# EAGLE design UFO (EAGLE 7.6.0)
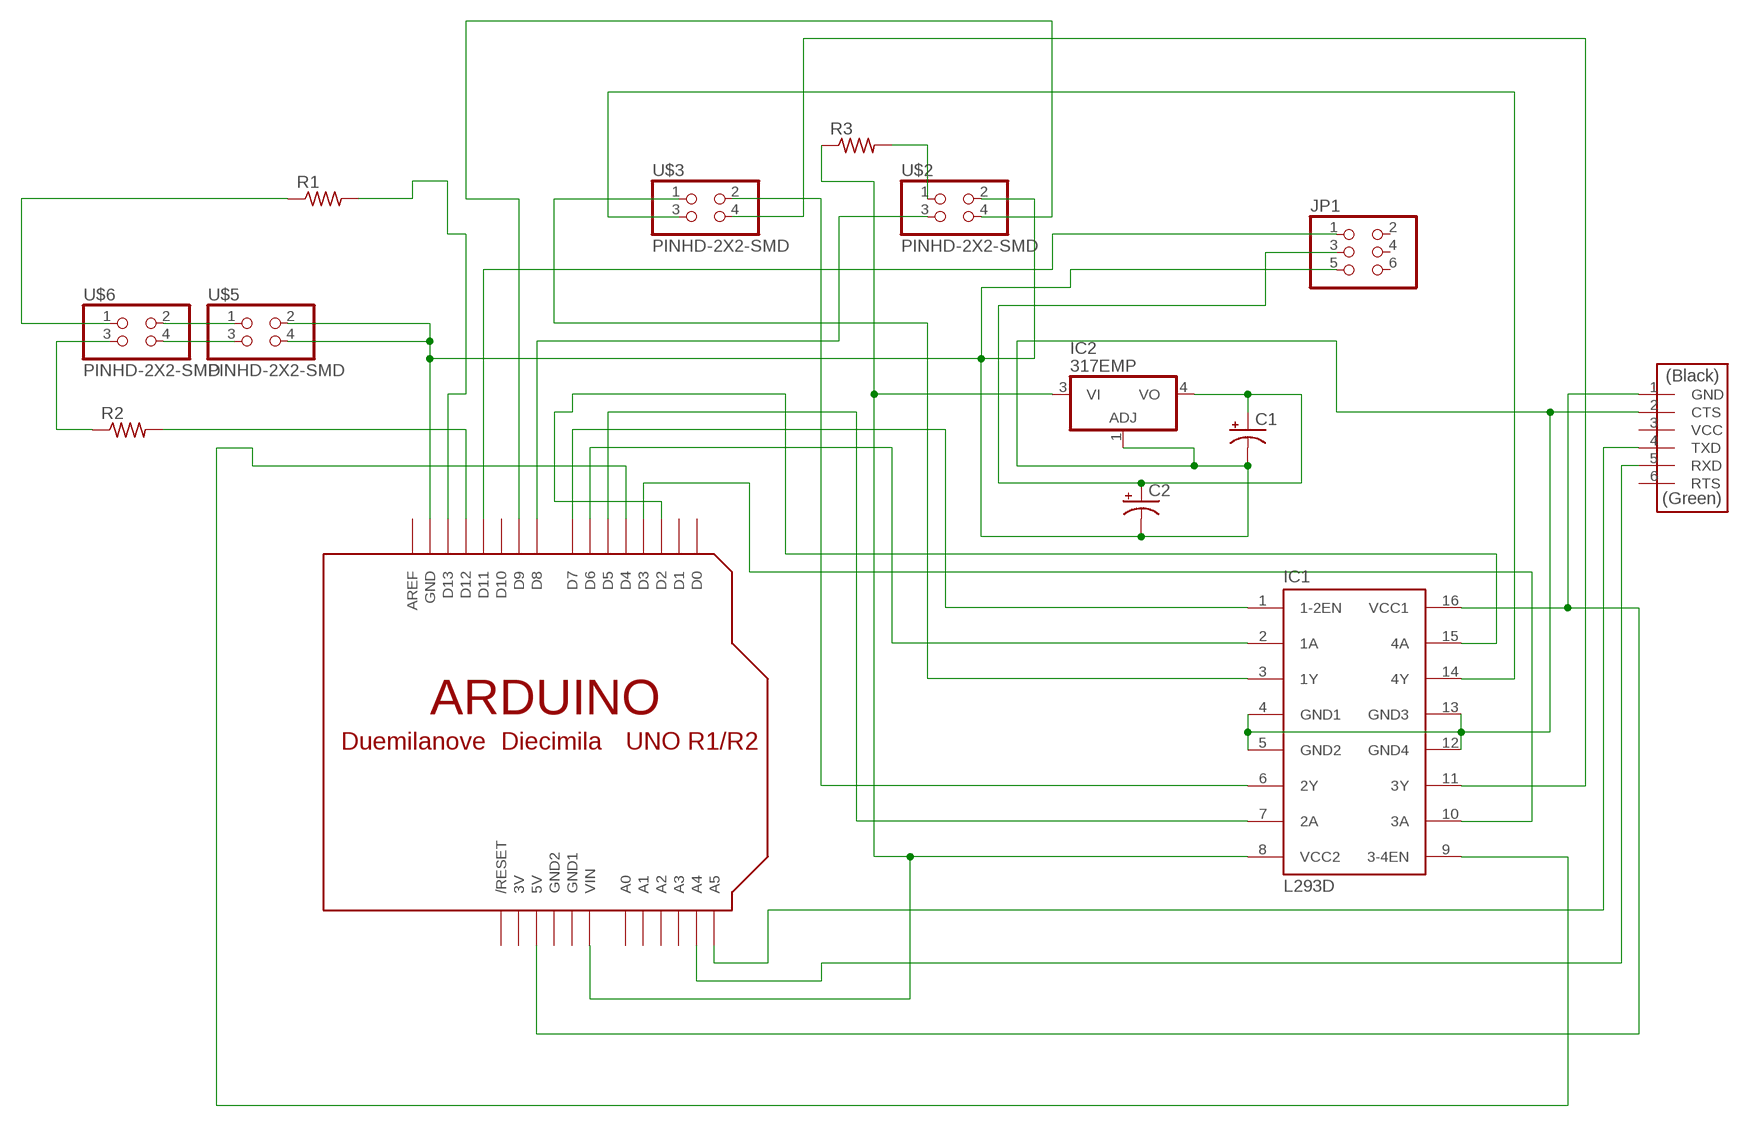
[diagram p0: schematic, sheet 1]

## Parts
C1  CPOL-USE/7260-38W  [E/7260-38W]
C2  CPOL-USE/7260-38W  [E/7260-38W]
IC1  L293D  [DIL16]
IC2  317EMP  [SOT223]
JP1  PINHD-2X3-SMD  [2X03SMD]
R1  RES-US1206  [R1206]
R2  RES-US1206  [R1206]
R3  RES-US1206FAB  [R1206FAB]
U$1  ARDUINO-NOHOLE  [ARDUINO-NOHOLE]
U$2  PINHD-2X2-SMD  [2X02SMD]
U$3  PINHD-2X2-SMD  [2X02SMD]
U$4  FTDI-SMD-HEADER  [1X06SMD]
U$5  PINHD-2X2-SMD  [2X02SMD]
U$6  PINHD-2X2-SMD  [2X02SMD]

## Nets
N$1: R3.2 U$2.1
N$3: IC1.1(1-2EN) U$1.D7
N$4: IC1.2(1A) U$1.D6
N$5: IC1.7(2A) U$1.D5
N$6: IC1.15(4A) U$1.D2
N$7: IC1.10(3A) U$1.D3
N$8: IC1.9(3-4EN) U$1.D4
N$9: IC1.3(1Y) U$3.1
N$10: IC1.6(2Y) U$3.2
N$11: IC1.14(4Y) U$3.3
N$12: IC1.11(3Y) U$3.4
N$13: IC1.8(VCC2) IC2.3(VI) R3.1 U$1.VIN
N$14: IC1.16(VCC1) U$1.5V U$4.1(GND)
N$16: R1.2 U$1.D13
N$17: C1.- C2.- IC1.4(GND1) IC1.5(GND2) IC1.12(GND4) IC1.13(GND3) IC2.1(ADJ) JP1.5 U$1.GND U$2.2 U$4.2(CTS) U$5.2 U$5.4
N$18: U$5.3 U$6.4
N$19: U$1.A5 U$4.4(TXD)
N$20: U$1.A4 U$4.5(RXD)
N$21: U$5.1 U$6.2
N$22: U$1.D8 U$2.3
N$23: U$1.D9 U$2.4
N$24: R2.2 U$1.D12
N$27: R2.1 U$6.3
N$28: R1.1 U$6.1
N$29: C1.+ C2.+ IC2.4(VO) JP1.3
N$30: JP1.1 U$1.D11
Unconnected: JP1.2 JP1.4 JP1.6 U$1.A0 U$1.A1 U$1.A2 U$1.A3 U$1.AREF U$1.D0 U$1.D1 U$1.D10 U$1.RESET(/RESET) U$4.3(VCC) U$4.6(RTS)

## Power pins joined to a net without a drawn wire
3V: U$1.3V
GND1: U$1.GND1
GND2: U$1.GND2

## Library data of the parts
C1 C2 = kesäseteli kirjasto:CPOL-US: POLARIZED CAPACITOR, American symbol
IC1 = kesäseteli kirjasto:L293D: PUSH-PULL 4 CHANNEL DRIVER; MPN: L293D; OC_FARNELL: 9589619; OC_NEWARK: 56P8249
IC2 = kesäseteli kirjasto:*317: Positive VOLTAGE REGULATOR
JP1 = kesäseteli kirjasto:PINHD-2X3-SMD: PIN HEADER
R1-R3 = kesäseteli kirjasto:RES-US: Resistor (US Symbol) Variants with postfix FAB are widened to allow the routing of internal traces
U$1 = kesäseteli kirjasto:ARDUINO: Arduino Diecimila/Duemilanove Make a shield with ease, this package has all the named pins as well as the two mounting drill holes and an outline of the USB and DC power connector. The outline is on the DIMENSION layer, so if your board house uses it they will cut the outline to match. http://www.ladyada.net/library/pcb/eaglelibrary.html
U$2 U$3 U$5 U$6 = kesäseteli kirjasto:PINHD-2X2-SMD
U$4 = kesäseteli kirjasto:FTDI-SMD-HEADER

## Board
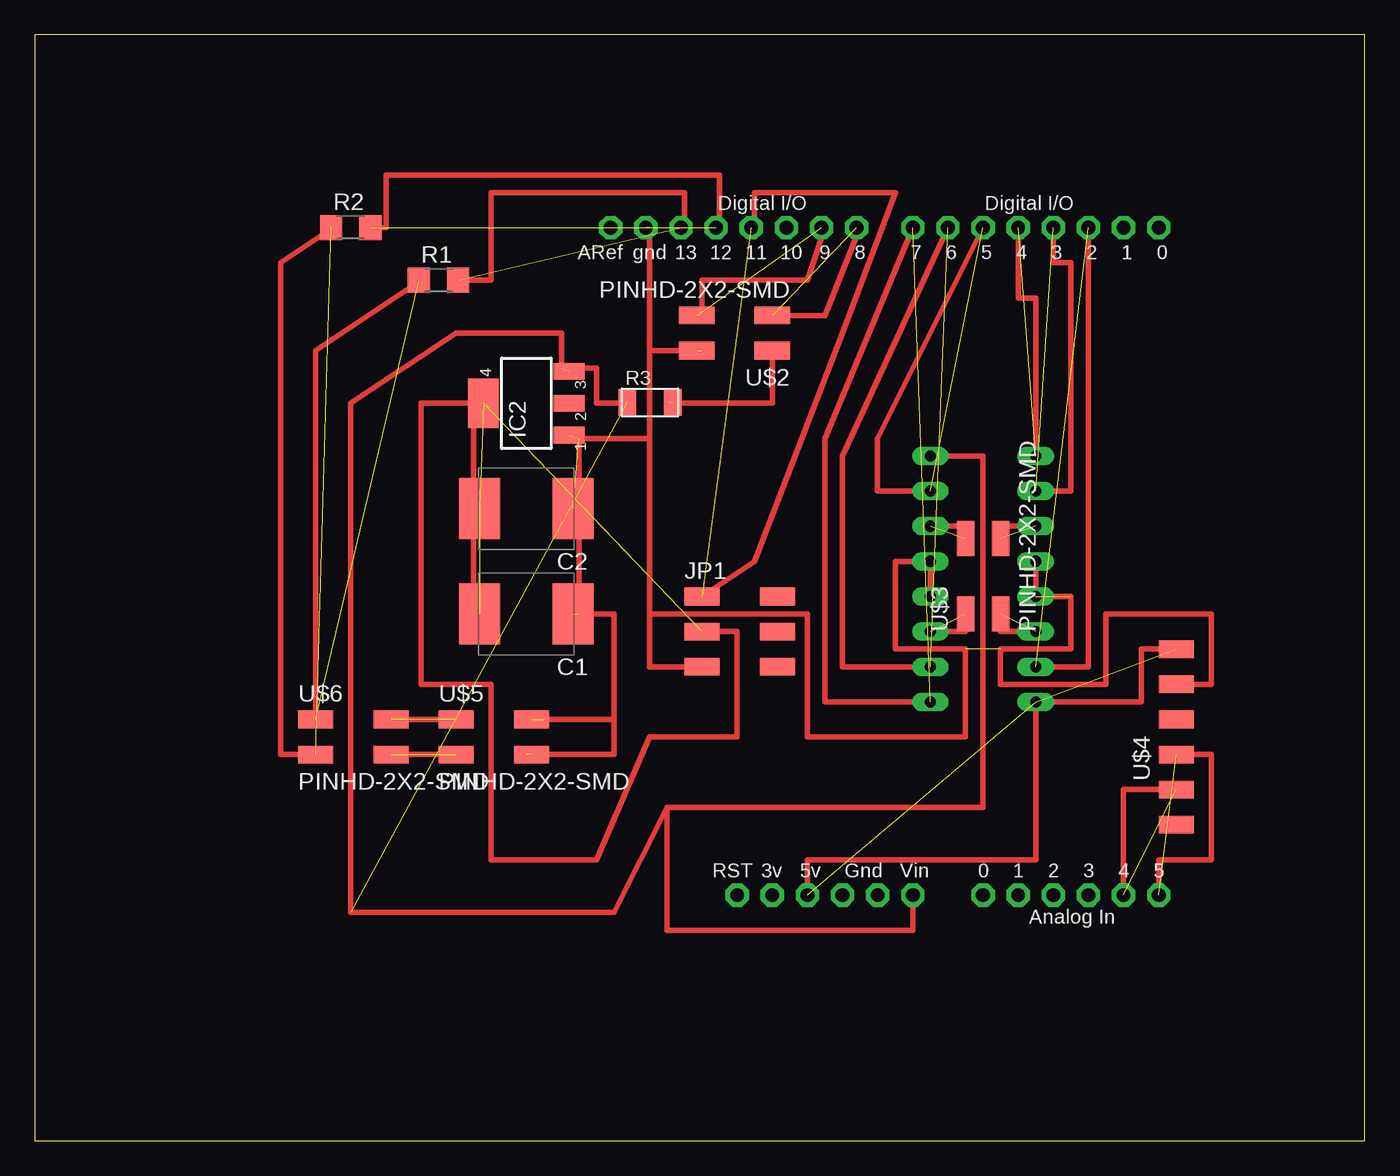
[diagram p1: board, top side]
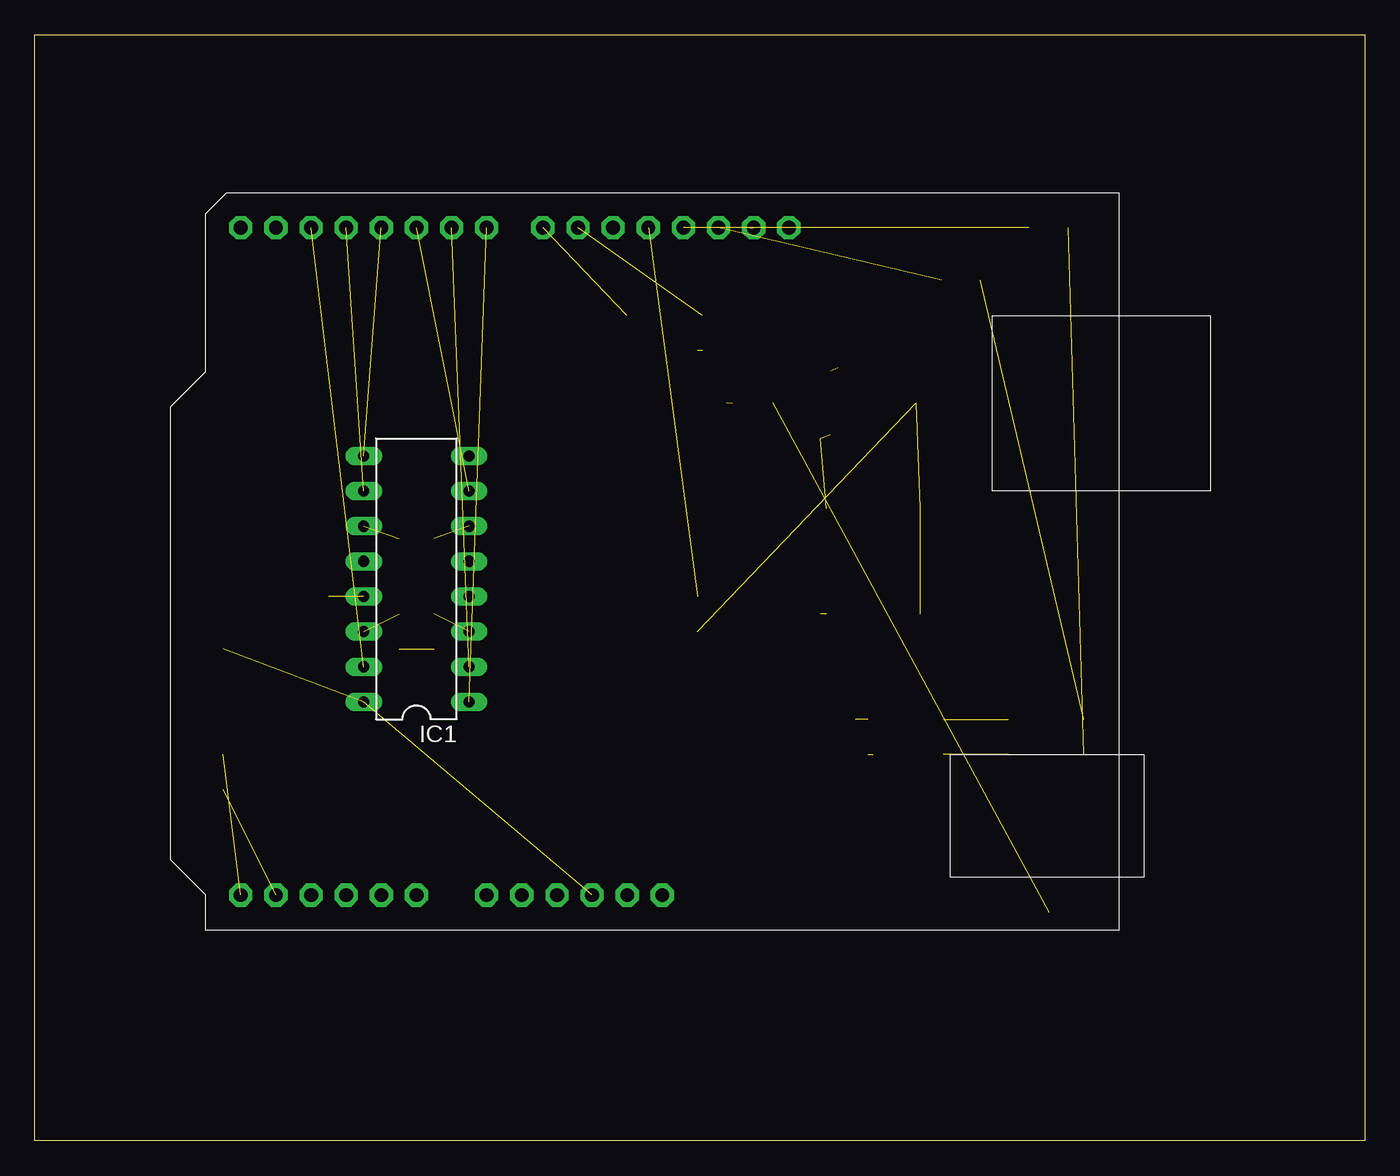
[diagram p2: board, bottom side, seen from below]

Size 96.19 x 80 mm. Coordinates in mm from the lower left corner, seen from the top.
Outline: 0,0 96.19,0 96.19,80 0,80 0,0
Copper layers (1*16): Top 0.035mm / dielectric 1.5mm / Bottom 0.035mm
Design rules "default": minimum track width 10mil, minimum drill 24mil, track to track 8mil, track to pad 8mil, pad to pad 8mil, via to via 8mil, smd to smd 8mil, copper to edge 40mil, drill to drill 8mil, minimum pad ring 10mil, minimum via ring 8mil, stop-mask expansion 4mil, vias tented up to drill 0mil, thermal gap 10mil

### Footprints (pad centres in the part's own frame; a part is rotated, then mirrored left to right if it is on the bottom)
E/7260-38W = smd 2.95 x 4.4: + 3.375,0; - -3.375,0
DIL16 = drill 0.813 long: 1 -8.89,-3.81; 2 -6.35,-3.81; 3 -3.81,-3.81; 4 -1.27,-3.81; 5 1.27,-3.81; 6 3.81,-3.81; 7 6.35,-3.81; 8 8.89,-3.81; 9 8.89,3.81; 10 6.35,3.81; 11 3.81,3.81; 12 1.27,3.81; 13 -1.27,3.81; 14 -3.81,3.81; 15 -6.35,3.81; 16 -8.89,3.81
SOT223 = smd 1.219 x 2.235: 1 -2.311,-3.099; 2 0,-3.099; 3 2.311,-3.099 | smd 3.6 x 2.2: 4 0,3.099
2X03SMD = smd 2.54 x 1.27: 1 -2.54,2.54; 2 2.92,2.54; 3 -2.54,0; 4 2.92,0; 5 -2.54,-2.54; 6 2.92,-2.54
R1206 = smd 1.6 x 1.803: 1 -1.422,0; 2 1.422,0
R1206FAB = smd 1.27 x 1.905: 1 -1.651,0; 2 1.651,0
ARDUINO-NOHOLE = drill 1 pad 1.676 octagon: 3V 35.56,2.54; 5V 38.1,2.54; A0 50.8,2.54; A1 53.34,2.54; A2 55.88,2.54; A3 58.42,2.54; A4 60.96,2.54; A5 63.5,2.54; AREF 23.876,50.8; D0 63.5,50.8; D1 60.96,50.8; D2 58.42,50.8; D3 55.88,50.8; D4 53.34,50.8; D5 50.8,50.8; D6 48.26,50.8; D7 45.72,50.8; D8 41.656,50.8; D9 39.116,50.8; D10 36.576,50.8; D11 34.036,50.8; D12 31.496,50.8; D13 28.956,50.8; GND 26.416,50.8; GND1 43.18,2.54; GND2 40.64,2.54; RESET 33.02,2.54; VIN 45.72,2.54
2X02SMD = smd 2.54 x 1.27: 1 -2.54,1.27; 2 2.92,1.27; 3 -2.54,-1.27; 4 2.92,-1.27
1X06SMD = smd 2.54 x 1.27: 1 0,6.35; 2 0,3.81; 3 0,1.27; 4 0,-1.27; 5 0,-3.81; 6 0,-6.35

### Placement (x,y rotation side)
C1  35.56,38.1 180 top
C2  35.56,45.72 180 top
IC1  68.58,40.64 90 bottom
IC2  35.56,53.34 90 top
JP1  50.8,36.83 0 top
R1  29.21,62.23 0 top
R2  22.86,66.04 0 top
R3  44.5,53.4 0 top
U$1  17.78,15.24 0 top
U$2  50.8,58.42 180 top
U$3  68.58,40.64 90 top
U$4  82.55,29.21 0 top
U$5  33.02,29.21 0 top
U$6  22.86,29.21 0 top

### Tracks (layer width: path | path; a pad name or v marks a point on that pad's centre or on a via)
N$1  (1 unrouted)
  Top 0.406: U$2.1 53.34,53.34 45.72,53.34
N$2
  Top 0.406: 49.53,66.04 49.53,69.85 25.4,69.85 25.4,66.04 24.13,66.04
N$3  (1 unrouted)
  Top 0.406: U$1.D7 57.15,50.8 57.15,31.75 IC1.1
N$4  (1 unrouted)
  Top 0.406: U$1.D6 58.42,49.53 58.42,34.29 IC1.2
N$5  (1 unrouted)
  Top 0.406: U$1.D5 60.96,50.8 60.96,46.99 IC1.7
N$6  (1 unrouted)
  Top 0.406: U$1.D2 76.2,34.29 IC1.15
N$7  (1 unrouted)
  Top 0.406: U$1.D3 73.66,63.5 74.93,63.5 74.93,46.99 IC1.10
N$8  (1 unrouted)
  Top 0.406: IC1.9 72.39,60.96 71.12,60.96 U$1.D4
N$9  (1 unrouted)
  Top 0.406: IC1.3 67.31,36.83 U$3.1
N$10  (1 unrouted)
  Top 0.406: IC1.6 67.31,44.45 67.31,43.18
N$11  (1 unrouted)
  Top 0.406: IC1.14 69.85,36.83 U$3.3
N$12  (1 unrouted)
  Top 0.406: IC1.11 69.85,44.45 69.85,43.18
N$13  (2 unrouted)
  Top 0.406: U$1.VIN 63.5,15.24 45.72,15.24 45.72,24.13 | 45.72,24.13 68.58,24.13 68.58,49.53 IC1.8 | 45.72,24.13 41.91,16.51 22.86,16.51 22.86,53.34 30.48,58.42 38.1,58.42 38.1,55.88
N$14  (2 unrouted)
  Top 0.406: U$1.5V 55.88,20.32 72.39,20.32 IC1.16 80.01,31.75 80.01,35.56 U$4.1
N$15
  Top 0.406: 43.18,53.34 40.64,53.34 40.64,55.88 39.37,55.88
N$16  (1 unrouted)
N$17  (9 unrouted)
  Top 0.406: 41.91,30.48 36.83,30.48 | 41.91,30.48 41.91,38.1 39.37,38.1 39.37,50.8 44.45,50.8 | 44.45,50.8 44.45,38.1 | 44.45,38.1 44.45,34.29 JP1.5 | 44.45,66.04 44.45,57.15 | 44.45,57.15 44.45,50.8 | 48.26,57.15 44.45,57.15 | 35.56,27.94 41.91,27.94 41.91,30.48 | U$4.2 85.09,33.02 85.09,38.1 77.47,38.1 77.47,33.02 69.85,33.02 69.85,35.56 74.93,35.56 74.93,39.37 IC1.13 IC1.12 | 44.45,38.1 55.88,38.1 55.88,29.21 67.31,29.21 67.31,35.56 62.23,35.56 62.23,41.91 IC1.5 IC1.4
N$18  (1 unrouted)
  Top 0.406: 25.4,27.94 U$5.3
N$19  (1 unrouted)
  Top 0.406: U$4.4 85.09,27.94 85.09,20.32 81.28,20.32 U$1.A5
N$20  (1 unrouted)
  Top 0.406: U$1.A4 78.74,25.4 U$4.5
N$21  (1 unrouted)
  Top 0.406: 25.4,30.48 U$5.1
N$22  (1 unrouted)
  Top 0.406: U$2.3 57.15,59.69 59.69,66.04
N$23  (1 unrouted)
N$24  (1 unrouted)
N$25
  Top 0.406: 46.99,66.04 46.99,68.58 33.02,68.58 33.02,62.23 30.48,62.23
N$26
  Top 0.406: 57.15,66.04 55.88,62.23 48.26,62.23 48.26,59.69
N$27  (1 unrouted)
  Top 0.406: 21.59,66.04 17.78,63.5 17.78,27.94 U$6.3
N$28  (1 unrouted)
  Top 0.406: 27.94,62.23 20.32,57.15 U$6.1
N$29  (3 unrouted)
  Top 0.406: 31.75,38.1 31.75,53.34 27.94,53.34 27.94,33.02 33.02,33.02 33.02,20.32 40.64,20.32 44.45,29.21 50.8,29.21 50.8,36.83 JP1.3
N$30  (1 unrouted)
  Top 0.406: 52.07,66.04 52.07,68.58 62.23,68.58 58.42,58.42 52.07,41.91 JP1.1